# EAGLE design FINAL_RNS (EAGLE 9.5.1)
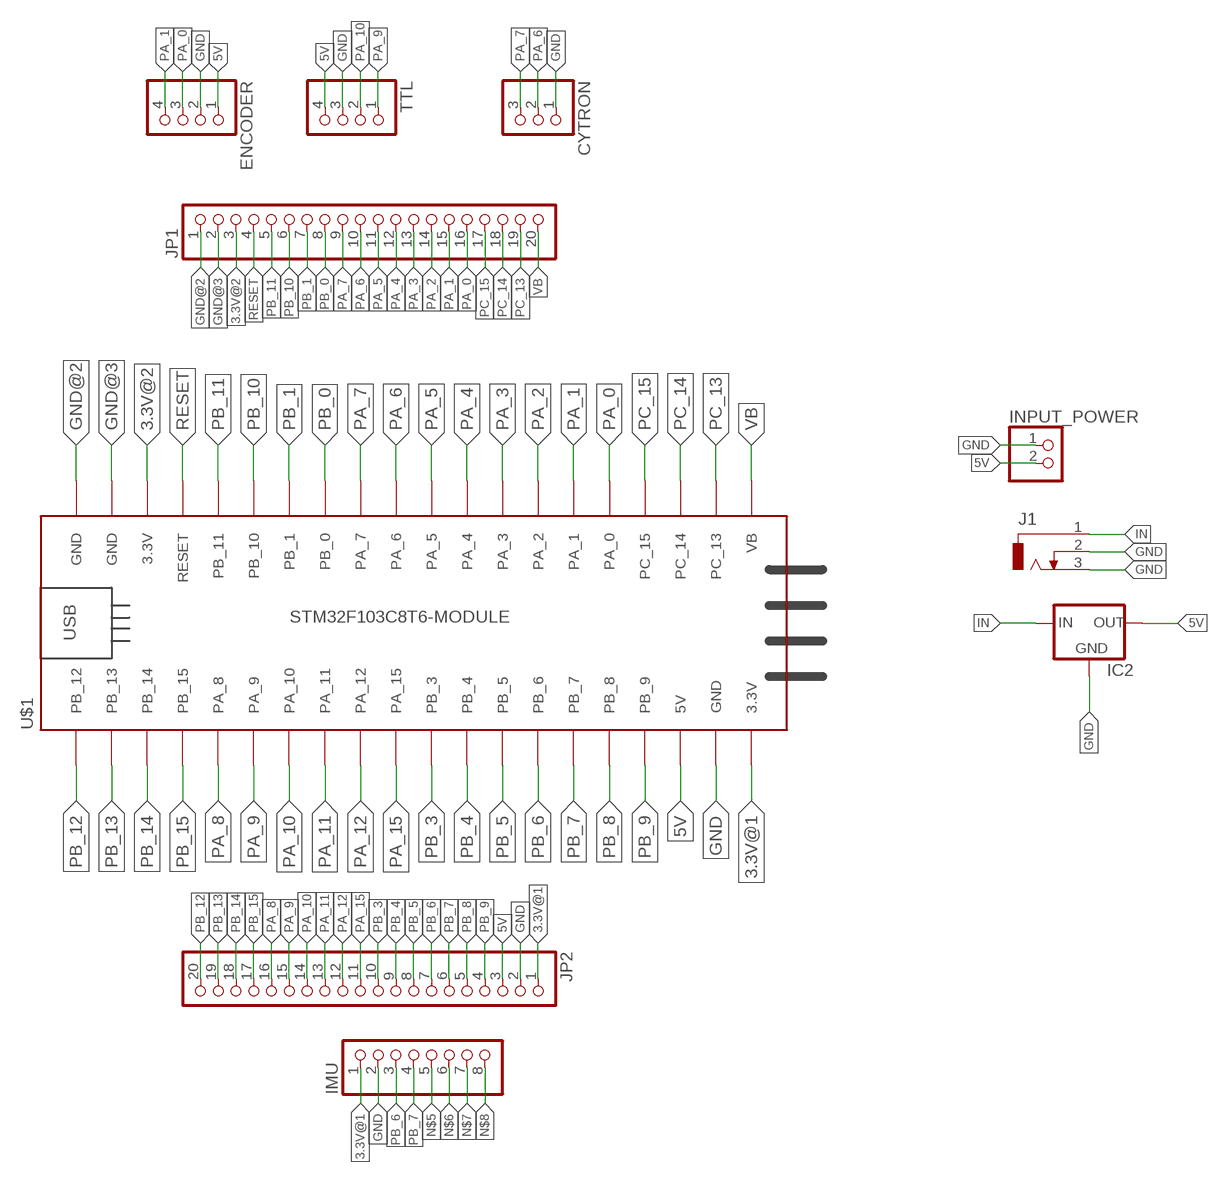
[diagram p0: schematic, sheet 1]

## Parts
CYTRON  PINHD-3_DATA  [1X03_DATA]
ENCODER  PINHD-4_DATA  [1X04_DATA]
IC2  78XXS  [78XXS]
IMU  PINHD-1X8  [1X08]
INPUT_POWER  PINHD-2_DATA  [1X02_DATA]
J1  CON_JACK  [DCJ0303]
JP1  PINHD-1X20  [1X20]
JP2  PINHD-1X20  [1X20]
TTL  PINHD-4_DATA  [1X04_DATA]
U$1  STM32F103C8T6-MODULE  [STM32F103C8T6-MODULE]

## Nets
3.3V@1: IMU.1 JP2.1 U$1.3.3V_1(3.3V)
3.3V@2: JP1.3 U$1.3.3V_2(3.3V)
5V: ENCODER.1 IC2.OUT INPUT_POWER.2 JP2.3 TTL.4 U$1.5V
GND: CYTRON.1 ENCODER.2 IC2.GND IMU.2 INPUT_POWER.1 J1.2 J1.3 JP2.2 TTL.3 U$1.GND_1(GND)
GND@2: JP1.1 U$1.GND_3(GND)
GND@3: JP1.2 U$1.GND_2(GND)
IN: IC2.IN J1.1
N$5: IMU.5
N$6: IMU.6
N$7: IMU.7
N$8: IMU.8
PA_0: ENCODER.3 JP1.16 U$1.PA_0
PA_1: ENCODER.4 JP1.15 U$1.PA_1
PA_2: JP1.14 U$1.PA_2
PA_3: JP1.13 U$1.PA_3
PA_4: JP1.12 U$1.PA_4
PA_5: JP1.11 U$1.PA_5
PA_6: CYTRON.2 JP1.10 U$1.PA_6
PA_7: CYTRON.3 JP1.9 U$1.PA_7
PA_8: JP2.16 U$1.PA_8
PA_9: JP2.15 TTL.1 U$1.PA_9
PA_10: JP2.14 TTL.2 U$1.PA_10
PA_11: JP2.13 U$1.PA_11
PA_12: JP2.12 U$1.PA_12
PA_15: JP2.11 U$1.PA_15
PB_0: JP1.8 U$1.PB_0
PB_1: JP1.7 U$1.PB_1
PB_3: JP2.10 U$1.PB_3
PB_4: JP2.9 U$1.PB_4
PB_5: JP2.8 U$1.PB_5
PB_6: IMU.3 JP2.7 U$1.PB_6
PB_7: IMU.4 JP2.6 U$1.PB_7
PB_8: JP2.5 U$1.PB_8
PB_9: JP2.4 U$1.PB_9
PB_10: JP1.6 U$1.PB_10
PB_11: JP1.5 U$1.PB_11
PB_12: JP2.20 U$1.PB_12
PB_13: JP2.19 U$1.PB_13
PB_14: JP2.18 U$1.PB_14
PB_15: JP2.17 U$1.PB_15
PC_13: JP1.19 U$1.PC_13
PC_14: JP1.18 U$1.PC_14
PC_15: JP1.17 U$1.PC_15
RESET: JP1.4 U$1.RESET
VB: JP1.20 U$1.VB

## Library data of the parts
CYTRON = MIA_LIBRARY-2-2-2:PINHD-3_DATA: PIN HEADER
ENCODER TTL = MIA_LIBRARY-2-2-2:PINHD-4_DATA: PIN HEADER
IC2 = MIA_LIBRARY-2-2-2:78XXS: VOLTAGE REGULATOR
IMU = MIA_LIBRARY-2-2-2:PINHD-1X8: PIN HEADER
INPUT_POWER = MIA_LIBRARY-2-2-2:PINHD-2_DATA: PIN HEADER
J1 = MIA_LIBRARY-2-2-2:CON_JACK: DC POWER JACK Source: DCJ0303.pdf; OC_FARNELL: unknown; OC_NEWARK: unknown
JP1 JP2 = MIA_LIBRARY-2-2-2:PINHD-1X20: PIN HEADER
U$1 = MIA_LIBRARY-2-2-2:STM32F103C8T6-MODULE: STM32F103C8T6 module with ARM Cortex-3, 20kB SRAM, 64kB Flash, 72MHz

## Board
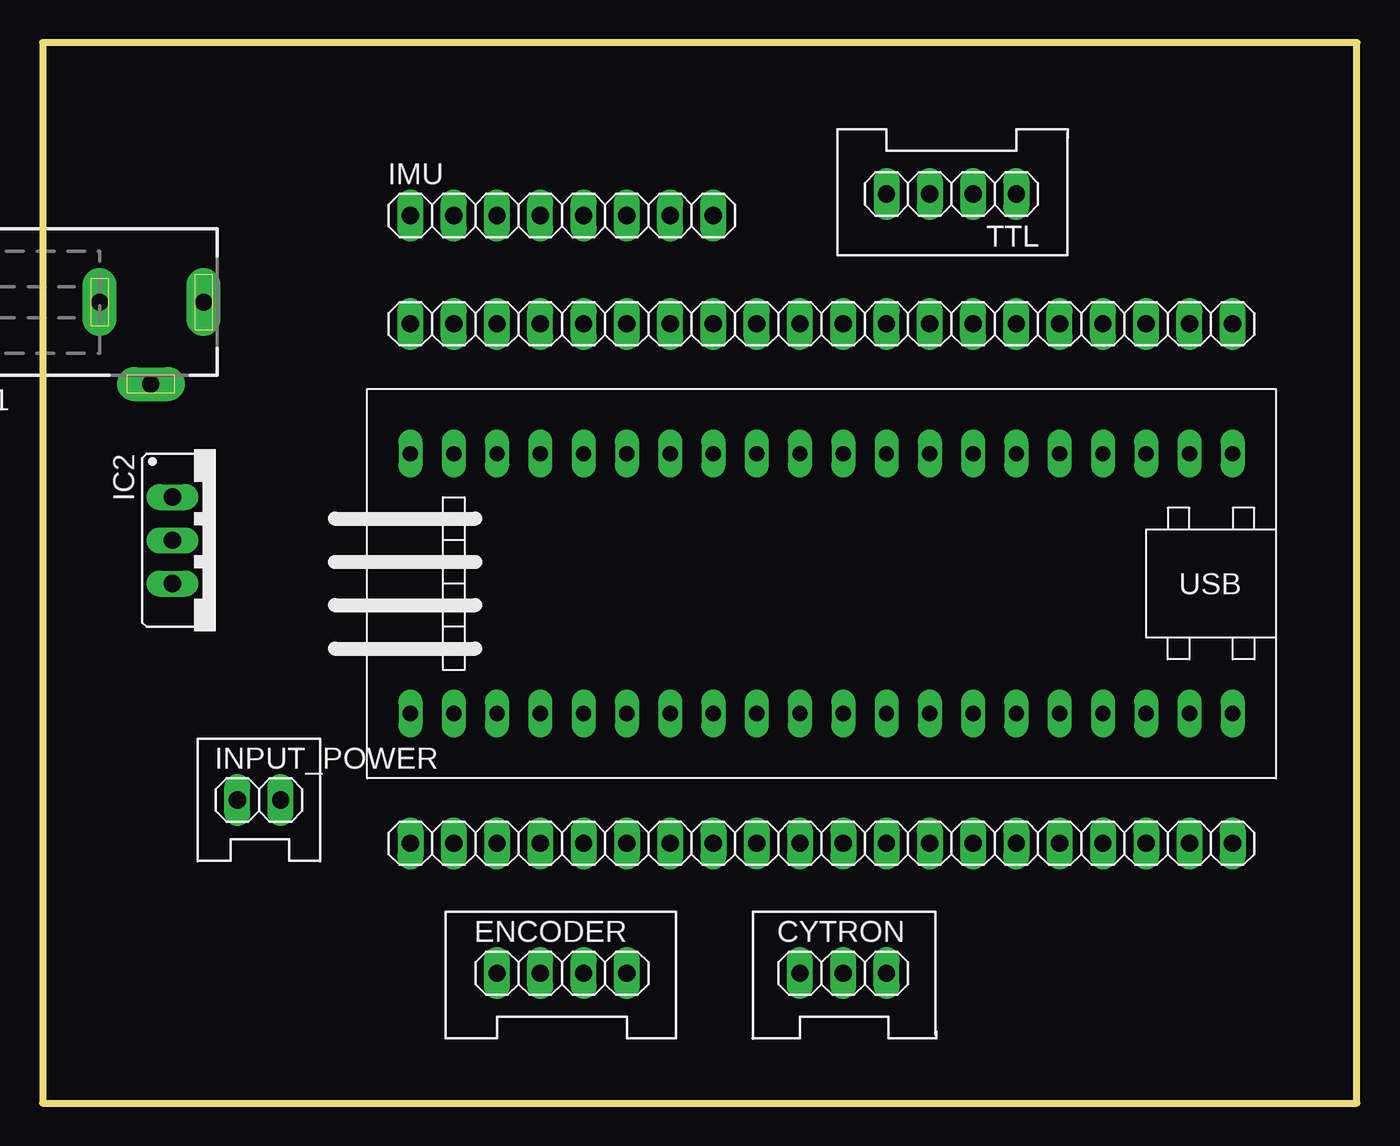
[diagram p1: board, top side]
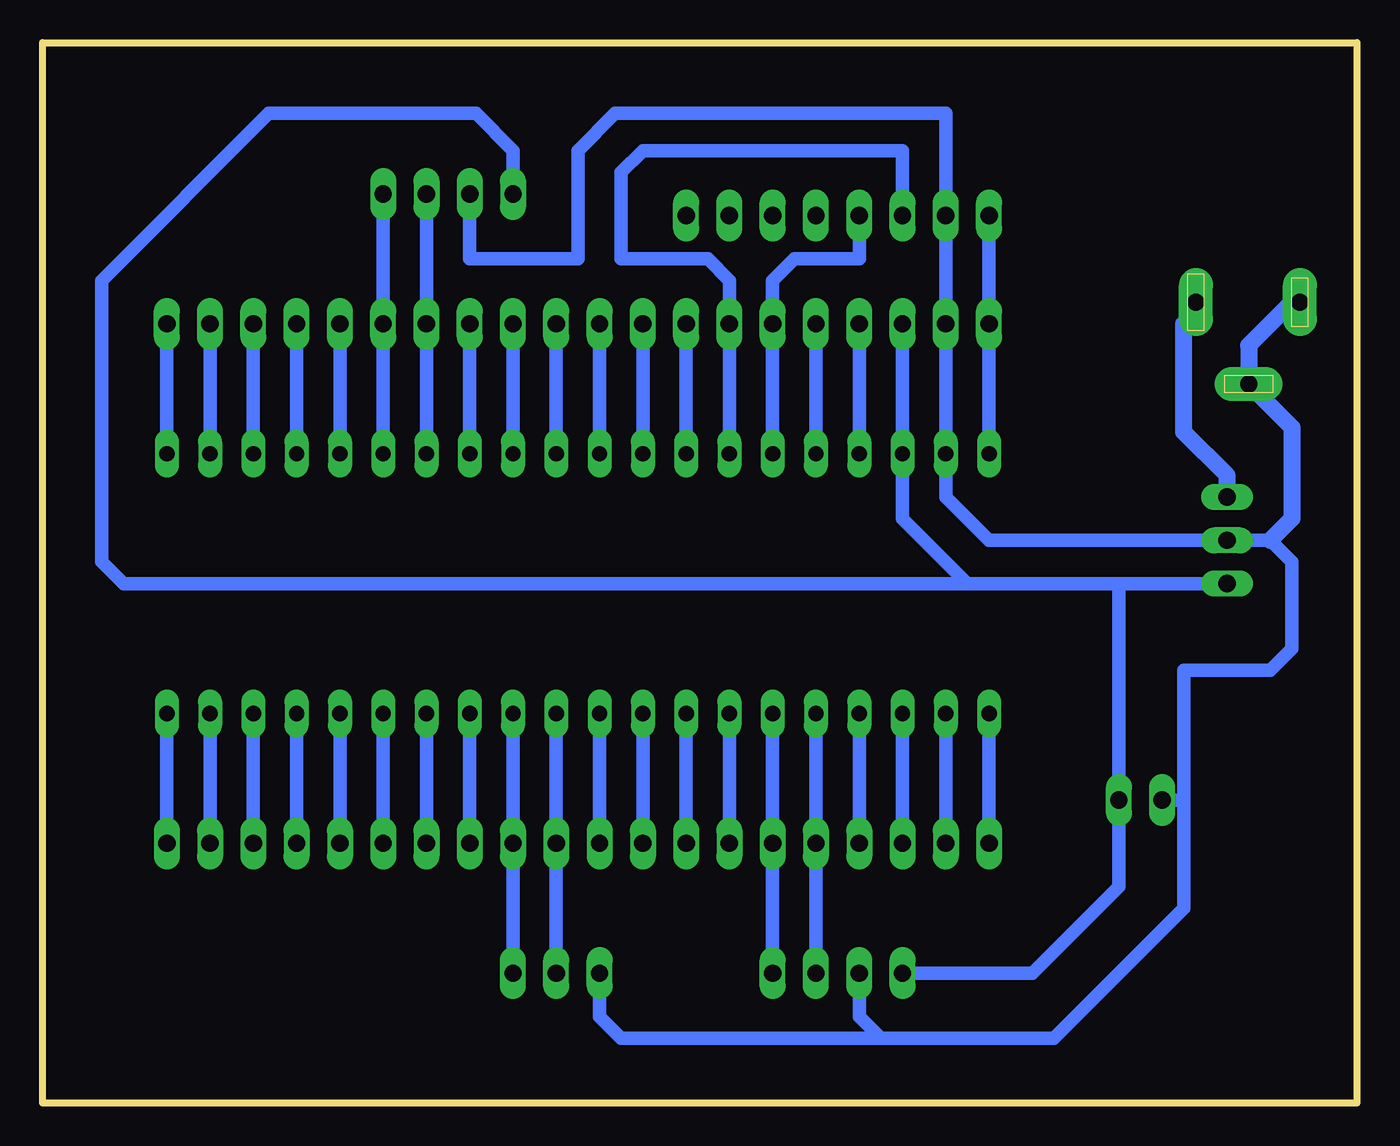
[diagram p2: board, bottom side, seen from below]

Size 77.14 x 62.22 mm. Coordinates in mm from the lower left corner, seen from the top.
Outline: 0,0 77.14,0 77.14,62.22 0,62.22 0,0
Copper layers (1*16): Top 0.035mm / dielectric 1.5mm / Bottom 0.035mm
Design rules "default": minimum track width 6mil, minimum drill 0.35mm, track to track 6mil, track to pad 6mil, pad to pad 6mil, via to via 6mil, smd to smd 6mil, copper to edge 40mil, drill to drill 6mil, minimum pad ring 10mil, minimum via ring 8mil, stop-mask expansion 4mil, vias tented up to drill 0mil, thermal gap 10mil

### Footprints (pad centres in the part's own frame; a part is rotated, then mirrored left to right if it is on the bottom)
1X03_DATA = drill 1.016 long: 1 -2.54,0; 2 0,0; 3 2.54,0
1X04_DATA = drill 1.016 long: 1 -3.81,0; 2 -1.27,0; 3 1.27,0; 4 3.81,0
78XXS = drill 1.016 long: GND 0,-2.54; IN -2.54,-2.54; OUT 2.54,-2.54
1X08 = drill 1.016 long: 1 -8.89,0; 2 -6.35,0; 3 -3.81,0; 4 -1.27,0; 5 1.27,0; 6 3.81,0; 7 6.35,0; 8 8.89,0
1X02_DATA = drill 1.016 long: 1 -1.27,0; 2 1.27,0
DCJ0303 = drill 1 pad 2 long: 1 0,3.1; 2 4.8,0; 3 0,-3
1X20 = drill 1.016 long: 1 -24.13,0; 2 -21.59,0; 3 -19.05,0; 4 -16.51,0; 5 -13.97,0; 6 -11.43,0; 7 -8.89,0; 8 -6.35,0; 9 -3.81,0; 10 -1.27,0; 11 1.27,0; 12 3.81,0; 13 6.35,0; 14 8.89,0; 15 11.43,0; 16 13.97,0; 17 16.51,0; 18 19.05,0; 19 21.59,0; 20 24.13,0
STM32F103C8T6-MODULE = drill 0.9 long: 3.3V_1 25.4,-7.62; 3.3V_2 -17.78,7.62; 5V 20.32,-7.62; GND_1 22.86,-7.62; GND_2 -20.32,7.62; GND_3 -22.86,7.62; PA_0 15.24,7.62; PA_1 12.7,7.62; PA_2 10.16,7.62; PA_3 7.62,7.62; PA_4 5.08,7.62; PA_5 2.54,7.62; PA_6 0,7.62; PA_7 -2.54,7.62; PA_8 -12.7,-7.62; PA_9 -10.16,-7.62; PA_10 -7.62,-7.62; PA_11 -5.08,-7.62; PA_12 -2.54,-7.62; PA_15 0,-7.62; PB_0 -5.08,7.62; PB_1 -7.62,7.62; PB_3 2.54,-7.62; PB_4 5.08,-7.62; PB_5 7.62,-7.62; PB_6 10.16,-7.62; PB_7 12.7,-7.62; PB_8 15.24,-7.62; PB_9 17.78,-7.62; PB_10 -10.16,7.62; PB_11 -12.7,7.62; PB_12 -22.86,-7.62; PB_13 -20.32,-7.62; PB_14 -17.78,-7.62; PB_15 -15.24,-7.62; PC_13 22.86,7.62; PC_14 20.32,7.62; PC_15 17.78,7.62; RESET -15.24,7.62; VB 25.4,7.62

### Placement (x,y rotation side)
CYTRON  46.99,7.62 0 top
ENCODER  30.48,7.62 0 top
IC2  10.16,33.02 270 top
IMU  30.48,52.07 0 top
INPUT_POWER  12.7,17.78 0 top
J1  6.35,46.99 270 top
JP1  45.72,15.24 180 top
JP2  45.72,45.72 0 top
TTL  53.34,53.34 180 top
U$1  46.99,30.48 180 top

### Tracks (layer width: path | path; a pad name or v marks a point on that pad's centre or on a via)
3.3V@1
  Bottom 0.8: U$1.3.3V_1 JP2.1 IMU.1
3.3V@2
  Bottom 0.8: JP1.3 U$1.3.3V_2
5V
  Bottom 0.8: JP2.3 U$1.5V 26.67,34.29 22.86,30.48 | IC2.OUT 13.97,30.48 | 13.97,30.48 22.86,30.48 | ENCODER.1 19.05,7.62 13.97,12.7 INPUT_POWER.2 13.97,30.48 | 22.86,30.48 72.39,30.48 73.66,31.75 73.66,48.26 63.86,58.06 51.71,58.06 49.53,55.88 TTL.4
GND
  Bottom 0.8: 27.94,3.81 29.21,5.08 ENCODER.2 | 27.94,3.81 17.78,3.81 10.16,11.43 10.16,17.78 | CYTRON.1 44.45,5.08 43.18,3.81 27.94,3.81 | TTL.3 52.07,49.53 45.72,49.53 45.72,55.88 43.54,58.06 24.13,58.06 IMU.2 JP2.2 U$1.GND_1 24.13,35.56 21.59,33.02 IC2.GND 5.08,33.02 3.81,31.75 3.81,26.67 5.08,25.4 10.16,25.4 10.16,17.78 | INPUT_POWER.1 10.16,17.78
  Bottom 1: J1.3 3.81,46.99 6.35,44.45 J1.2 3.81,39.65 3.81,34.29 5.08,33.02
GND@2
  Bottom 0.8: JP1.1 U$1.GND_3
GND@3
  Bottom 0.8: JP1.2 U$1.GND_2
IN
  Bottom 1: IC2.IN 7.62,36.83 10.16,39.37 10.16,45.72 9.45,46.43 J1.1
PA_0
  Bottom 0.8: U$1.PA_0 JP1.16 ENCODER.3
PA_1
  Bottom 0.8: U$1.PA_1 JP1.15 ENCODER.4
PA_2
  Bottom 0.8: JP1.14 U$1.PA_2
PA_3
  Bottom 0.8: JP1.13 U$1.PA_3
PA_4
  Bottom 0.8: JP1.12 U$1.PA_4
PA_5
  Bottom 0.8: JP1.11 U$1.PA_5
PA_6
  Bottom 0.8: U$1.PA_6 JP1.10 CYTRON.2
PA_7
  Bottom 0.8: U$1.PA_7 JP1.9 CYTRON.3
PA_8
  Bottom 0.8: U$1.PA_8 JP2.16
PA_9
  Bottom 0.8: U$1.PA_9 JP2.15 TTL.1
PA_10
  Bottom 0.8: U$1.PA_10 JP2.14 TTL.2
PA_11
  Bottom 0.8: U$1.PA_11 JP2.13
PA_12
  Bottom 0.8: U$1.PA_12 JP2.12
PA_15
  Bottom 0.8: U$1.PA_15 JP2.11
PB_0
  Bottom 0.8: JP1.8 U$1.PB_0
PB_1
  Bottom 0.8: JP1.7 U$1.PB_1
PB_3
  Bottom 0.8: U$1.PB_3 JP2.10
PB_4
  Bottom 0.8: U$1.PB_4 JP2.9
PB_5
  Bottom 0.8: U$1.PB_5 JP2.8
PB_6
  Bottom 0.8: U$1.PB_6 JP2.7 36.83,48.26 38.1,49.53 43.18,49.53 43.18,54.61 41.91,55.88 26.67,55.88 IMU.3
PB_7
  Bottom 0.8: U$1.PB_7 JP2.6 | 34.29,46.99 JP2.6 | JP2.6 34.29,48.26 33.02,49.53 29.21,49.53 IMU.4
PB_8
  Bottom 0.8: U$1.PB_8 JP2.5
PB_9
  Bottom 0.8: U$1.PB_9 JP2.4
PB_10
  Bottom 0.8: JP1.6 U$1.PB_10
PB_11
  Bottom 0.8: JP1.5 U$1.PB_11
PB_12
  Bottom 0.8: U$1.PB_12 JP2.20
PB_13
  Bottom 0.8: U$1.PB_13 JP2.19
PB_14
  Bottom 0.8: U$1.PB_14 JP2.18
PB_15
  Bottom 0.8: U$1.PB_15 JP2.17
PC_13
  Bottom 0.8: JP1.19 U$1.PC_13
PC_14
  Bottom 0.8: JP1.18 U$1.PC_14
PC_15
  Bottom 0.8: JP1.17 U$1.PC_15
RESET
  Bottom 0.8: JP1.4 U$1.RESET
VB
  Bottom 0.8: JP1.20 U$1.VB